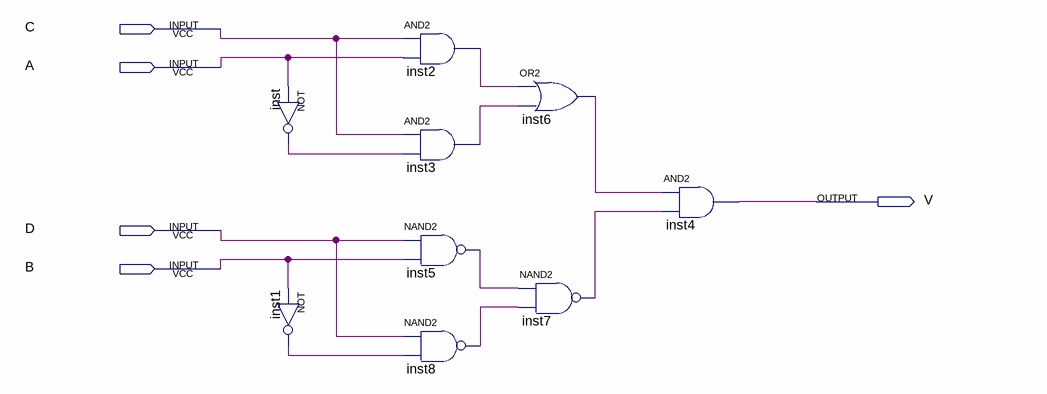
[diagram p0: schematic sheet]
// Quartus schematic The_And_Circuit.bdf as structural Verilog: 9 symbols, 5 pins
module The_And_Circuit (
  input  C,
  input  A,
  input  D,
  input  B,
  output V
);

  wire inst1_out, inst2_out, inst3_out, inst5_out, inst6_out, inst7_out, inst8_out, inst_out;

  not inst (inst_out, A);
  not inst1 (inst1_out, B);
  and inst2 (inst2_out, C, A);
  and inst3 (inst3_out, C, inst_out);
  nand inst5 (inst5_out, D, B);
  nand inst8 (inst8_out, D, inst1_out);
  or inst6 (inst6_out, inst2_out, inst3_out);
  nand inst7 (inst7_out, inst5_out, inst8_out);
  and inst4 (V, inst6_out, inst7_out);
endmodule
